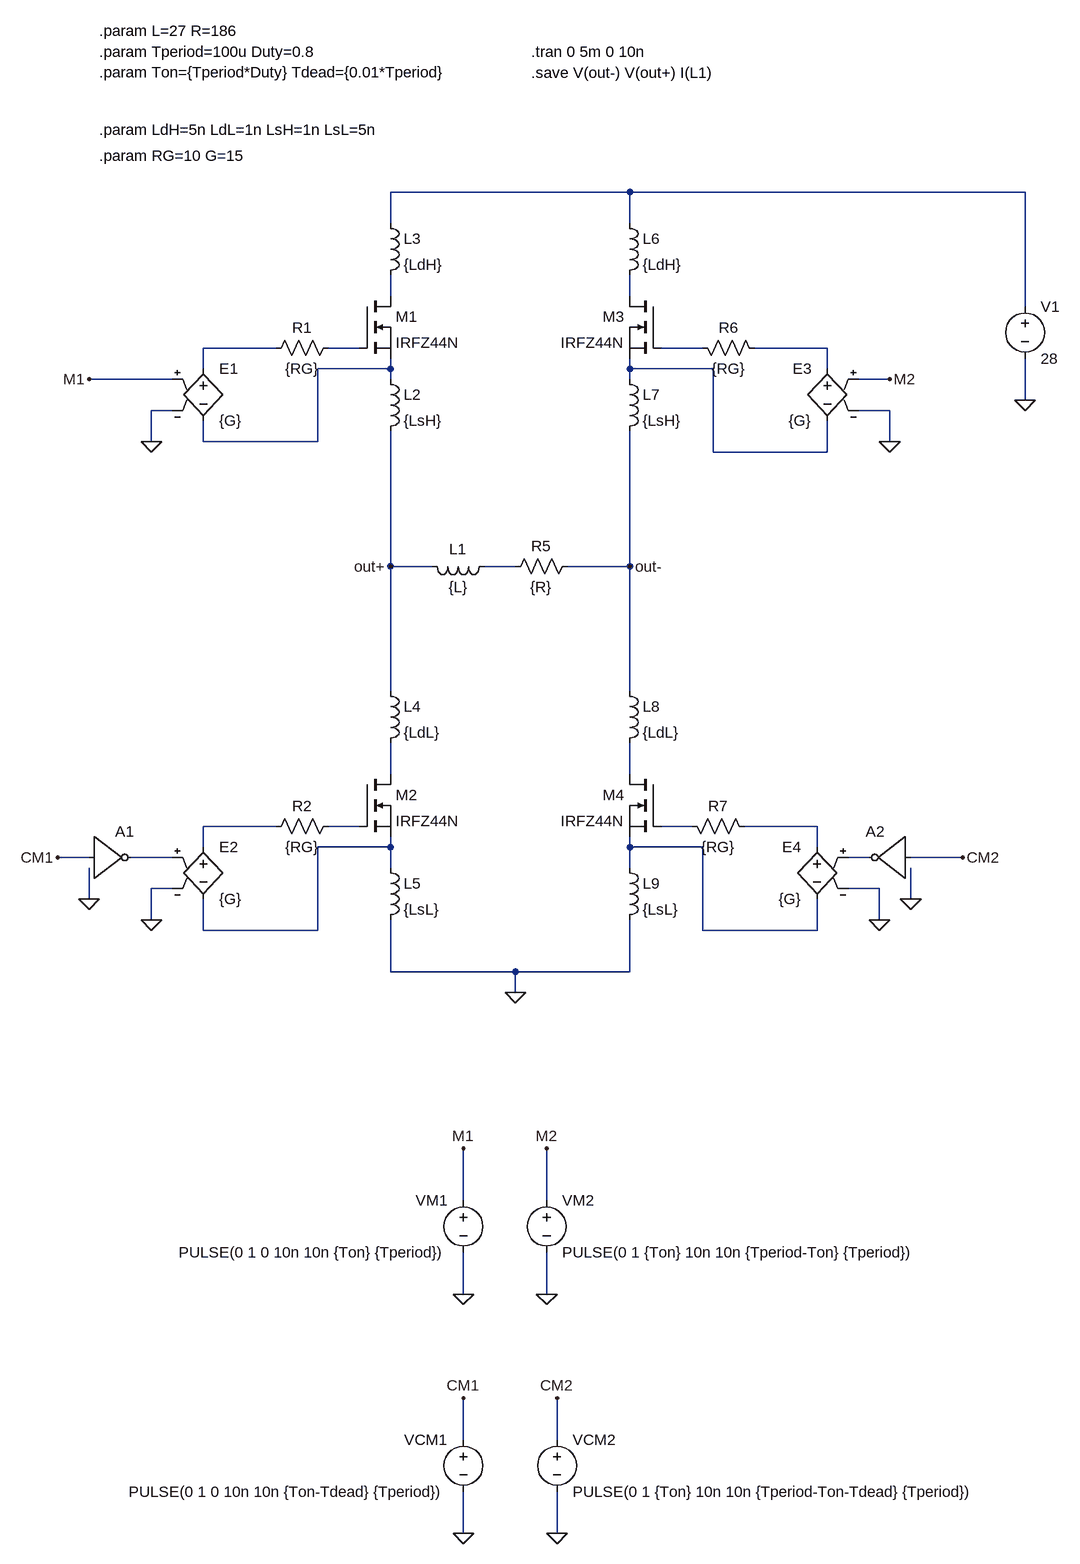
[diagram p0: schematic non_idela_bridge.asc]
non_idela_bridge.asc, the LTspice schematic file:
Version 4
SHEET 1 2924 1796
WIRE 816 -288 448 -288
WIRE 1424 -288 816 -288
WIRE 448 -240 448 -288
WIRE 816 -240 816 -288
WIRE 448 -128 448 -160
WIRE 816 -128 816 -160
WIRE 1424 -112 1424 -288
WIRE 272 -48 160 -48
WIRE 400 -48 352 -48
WIRE 928 -48 864 -48
WIRE 1120 -48 1008 -48
WIRE 160 -16 160 -48
WIRE 448 -16 448 -32
WIRE 448 -16 336 -16
WIRE 816 -16 816 -32
WIRE 944 -16 816 -16
WIRE 1120 -16 1120 -48
WIRE 112 0 -16 0
WIRE 448 0 448 -16
WIRE 816 0 816 -16
WIRE 1216 0 1168 0
WIRE 1424 32 1424 -32
WIRE 112 48 80 48
WIRE 1216 48 1168 48
WIRE 80 96 80 48
WIRE 160 96 160 64
WIRE 336 96 336 -16
WIRE 336 96 160 96
WIRE 1216 96 1216 48
WIRE 944 112 944 -16
WIRE 1120 112 1120 64
WIRE 1120 112 944 112
WIRE 448 288 448 80
WIRE 512 288 448 288
WIRE 640 288 592 288
WIRE 816 288 816 80
WIRE 816 288 720 288
WIRE 448 480 448 288
WIRE 816 480 816 288
WIRE 448 608 448 560
WIRE 816 608 816 560
WIRE 272 688 160 688
WIRE 400 688 352 688
WIRE 912 688 864 688
WIRE 1104 688 992 688
WIRE 160 720 160 688
WIRE 448 720 448 704
WIRE 448 720 336 720
WIRE 816 720 816 704
WIRE 928 720 816 720
WIRE 1104 720 1104 688
WIRE -16 736 -64 736
WIRE 112 736 48 736
WIRE 1184 736 1152 736
WIRE 1328 736 1248 736
WIRE 448 752 448 720
WIRE 816 752 816 720
WIRE 112 784 80 784
WIRE 1200 784 1152 784
WIRE -16 800 -16 752
WIRE 1248 800 1248 752
WIRE 80 832 80 784
WIRE 1200 832 1200 784
WIRE 160 848 160 800
WIRE 336 848 336 720
WIRE 336 848 160 848
WIRE 928 848 928 720
WIRE 1104 848 1104 800
WIRE 1104 848 928 848
WIRE 448 912 448 832
WIRE 640 912 448 912
WIRE 816 912 816 832
WIRE 816 912 640 912
WIRE 640 944 640 912
WIRE 560 1264 560 1184
WIRE 688 1264 688 1184
WIRE 560 1408 560 1344
WIRE 688 1408 688 1344
WIRE 560 1632 560 1568
WIRE 704 1632 704 1568
WIRE 560 1776 560 1712
WIRE 704 1776 704 1712
FLAG 1424 32 0
FLAG 640 944 0
FLAG 80 96 0
FLAG 80 832 0
FLAG 1216 96 0
FLAG 1200 832 0
FLAG -16 800 0
FLAG -64 736 CM1
FLAG -16 0 M1
FLAG 1216 0 M2
FLAG 1248 800 0
FLAG 1328 736 CM2
FLAG 560 1408 0
FLAG 688 1408 0
FLAG 560 1184 M1
FLAG 688 1184 M2
FLAG 816 288 out-
FLAG 448 288 out+
FLAG 560 1776 0
FLAG 560 1568 CM1
FLAG 704 1568 CM2
FLAG 704 1776 0
SYMBOL voltage 1424 -128 R0
WINDOW 123 0 0 Left 0
WINDOW 39 0 0 Left 0
SYMATTR InstName V1
SYMATTR Value 28
SYMBOL nmos 400 -128 R0
SYMATTR InstName M1
SYMATTR Value IRFZ44N
SYMBOL nmos 400 608 R0
SYMATTR InstName M2
SYMATTR Value IRFZ44N
SYMBOL nmos 864 -128 M0
SYMATTR InstName M3
SYMATTR Value IRFZ44N
SYMBOL nmos 864 608 M0
SYMATTR InstName M4
SYMATTR Value IRFZ44N
SYMBOL res 368 -64 R90
WINDOW 0 0 56 VBottom 2
WINDOW 3 32 56 VTop 2
SYMATTR InstName R1
SYMATTR Value {RG}
SYMBOL res 368 672 R90
WINDOW 0 0 56 VBottom 2
WINDOW 3 32 56 VTop 2
SYMATTR InstName R2
SYMATTR Value {RG}
SYMBOL ind 608 272 R90
WINDOW 0 5 56 VBottom 2
WINDOW 3 32 56 VTop 2
SYMATTR InstName L1
SYMATTR Value {L}
SYMBOL res 736 272 R90
WINDOW 0 0 56 VBottom 2
WINDOW 3 32 56 VTop 2
SYMATTR InstName R5
SYMATTR Value {R}
SYMBOL e 160 -32 R0
SYMATTR InstName E1
SYMATTR Value {G}
SYMBOL e 160 704 R0
SYMATTR InstName E2
SYMATTR Value {G}
SYMBOL res 912 -64 M90
WINDOW 0 0 56 VBottom 2
WINDOW 3 32 56 VTop 2
SYMATTR InstName R6
SYMATTR Value {RG}
SYMBOL e 1120 -32 M0
SYMATTR InstName E3
SYMATTR Value {G}
SYMBOL res 896 672 M90
WINDOW 0 0 56 VBottom 2
WINDOW 3 32 56 VTop 2
SYMATTR InstName R7
SYMATTR Value {RG}
SYMBOL e 1104 704 M0
SYMATTR InstName E4
SYMATTR Value {G}
SYMBOL Digital\\inv -16 672 R0
SYMATTR InstName A1
SYMBOL Digital\\inv 1248 672 M0
SYMATTR InstName A2
SYMBOL voltage 560 1248 M0
WINDOW 123 0 0 Left 0
WINDOW 39 0 0 Left 0
SYMATTR InstName VM1
SYMATTR Value PULSE(0 1 0 10n 10n {Ton} {Tperiod})
SYMBOL voltage 688 1248 R0
WINDOW 123 0 0 Left 0
WINDOW 39 0 0 Left 0
SYMATTR InstName VM2
SYMATTR Value PULSE(0 1 {Ton} 10n 10n {Tperiod-Ton} {Tperiod})
SYMBOL voltage 560 1616 M0
WINDOW 123 0 0 Left 0
WINDOW 39 0 0 Left 0
SYMATTR InstName VCM1
SYMATTR Value PULSE(0 1 0 10n 10n {Ton-Tdead} {Tperiod})
SYMBOL voltage 704 1616 R0
WINDOW 123 0 0 Left 0
WINDOW 39 0 0 Left 0
SYMATTR InstName VCM2
SYMATTR Value PULSE(0 1 {Ton} 10n 10n {Tperiod-Ton-Tdead} {Tperiod})
SYMBOL ind 432 -16 R0
SYMATTR InstName L2
SYMATTR Value {LsH}
SYMBOL ind 432 -256 R0
SYMATTR InstName L3
SYMATTR Value {LdH}
SYMBOL ind 432 464 R0
SYMATTR InstName L4
SYMATTR Value {LdL}
SYMBOL ind 432 736 R0
SYMATTR InstName L5
SYMATTR Value {LsL}
SYMBOL ind 800 -256 R0
SYMATTR InstName L6
SYMATTR Value {LdH}
SYMBOL ind 800 -16 R0
SYMATTR InstName L7
SYMATTR Value {LsH}
SYMBOL ind 800 464 R0
SYMATTR InstName L8
SYMATTR Value {LdL}
SYMBOL ind 800 736 R0
SYMATTR InstName L9
SYMATTR Value {LsL}
TEXT 664 -504 Left 2 !.tran 0 5m 0 10n
TEXT 0 -504 Left 2 !.param Tperiod=100u Duty=0.8 \n.param Ton={Tperiod*Duty} Tdead={0.01*Tperiod}
TEXT 664 -472 Left 2 !.save V(out-) V(out+) I(L1)
TEXT 0 -536 Left 2 !.param L=27 R=186
TEXT 0 -384 Left 2 !.param LdH=5n LdL=1n LsH=1n LsL=5n
TEXT 0 -344 Left 2 !.param RG=10 G=15

The netlist it stands for:
* non_idela_bridge.asc
V1 N001 0 28
M1 N002 N005 N008 N008 IRFZ44N
M2 N011 N014 N017 N017 IRFZ44N
M3 N003 N006 N009 N009 IRFZ44N
M4 N012 N015 N018 N018 IRFZ44N
R1 N005 N004 {RG}
R2 N014 N013 {RG}
L1 N010 out+ {L}
R5 out- N010 {R}
E1 N004 N008 M1 0 {G}
E2 N013 N017 N019 0 {G}
R6 N006 N007 {RG}
E3 N007 N009 M2 0 {G}
R7 N015 N016 {RG}
E4 N016 N018 N020 0 {G}
A1 CM1 0 0 0 0 N019 0 0 BUF
A2 CM2 0 0 0 0 N020 0 0 BUF
VM1 M1 0 PULSE(0 1 0 10n 10n {Ton} {Tperiod})
VM2 M2 0 PULSE(0 1 {Ton} 10n 10n {Tperiod-Ton} {Tperiod})
VCM1 CM1 0 PULSE(0 1 0 10n 10n {Ton-Tdead} {Tperiod})
VCM2 CM2 0 PULSE(0 1 {Ton} 10n 10n {Tperiod-Ton-Tdead} {Tperiod})
L2 N008 out+ {LsH}
L3 N001 N002 {LdH}
L4 out+ N011 {LdL}
L5 N017 0 {LsL}
L6 N001 N003 {LdH}
L7 N009 out- {LsH}
L8 out- N012 {LdL}
L9 N018 0 {LsL}
.model NMOS NMOS
.model PMOS PMOS
.lib standard.mos
.tran 0 5m 0 10n
.param Tperiod=100u Duty=0.8
.param Ton={Tperiod*Duty} Tdead={0.01*Tperiod}
.save V(out-) V(out+) I(L1)
.param L=27 R=186
.param LdH=5n LdL=1n LsH=1n LsL=5n
.param RG=10 G=15
.backanno
.end